# EAGLE design bme680_breakout_v01 (EAGLE 9.6.2)
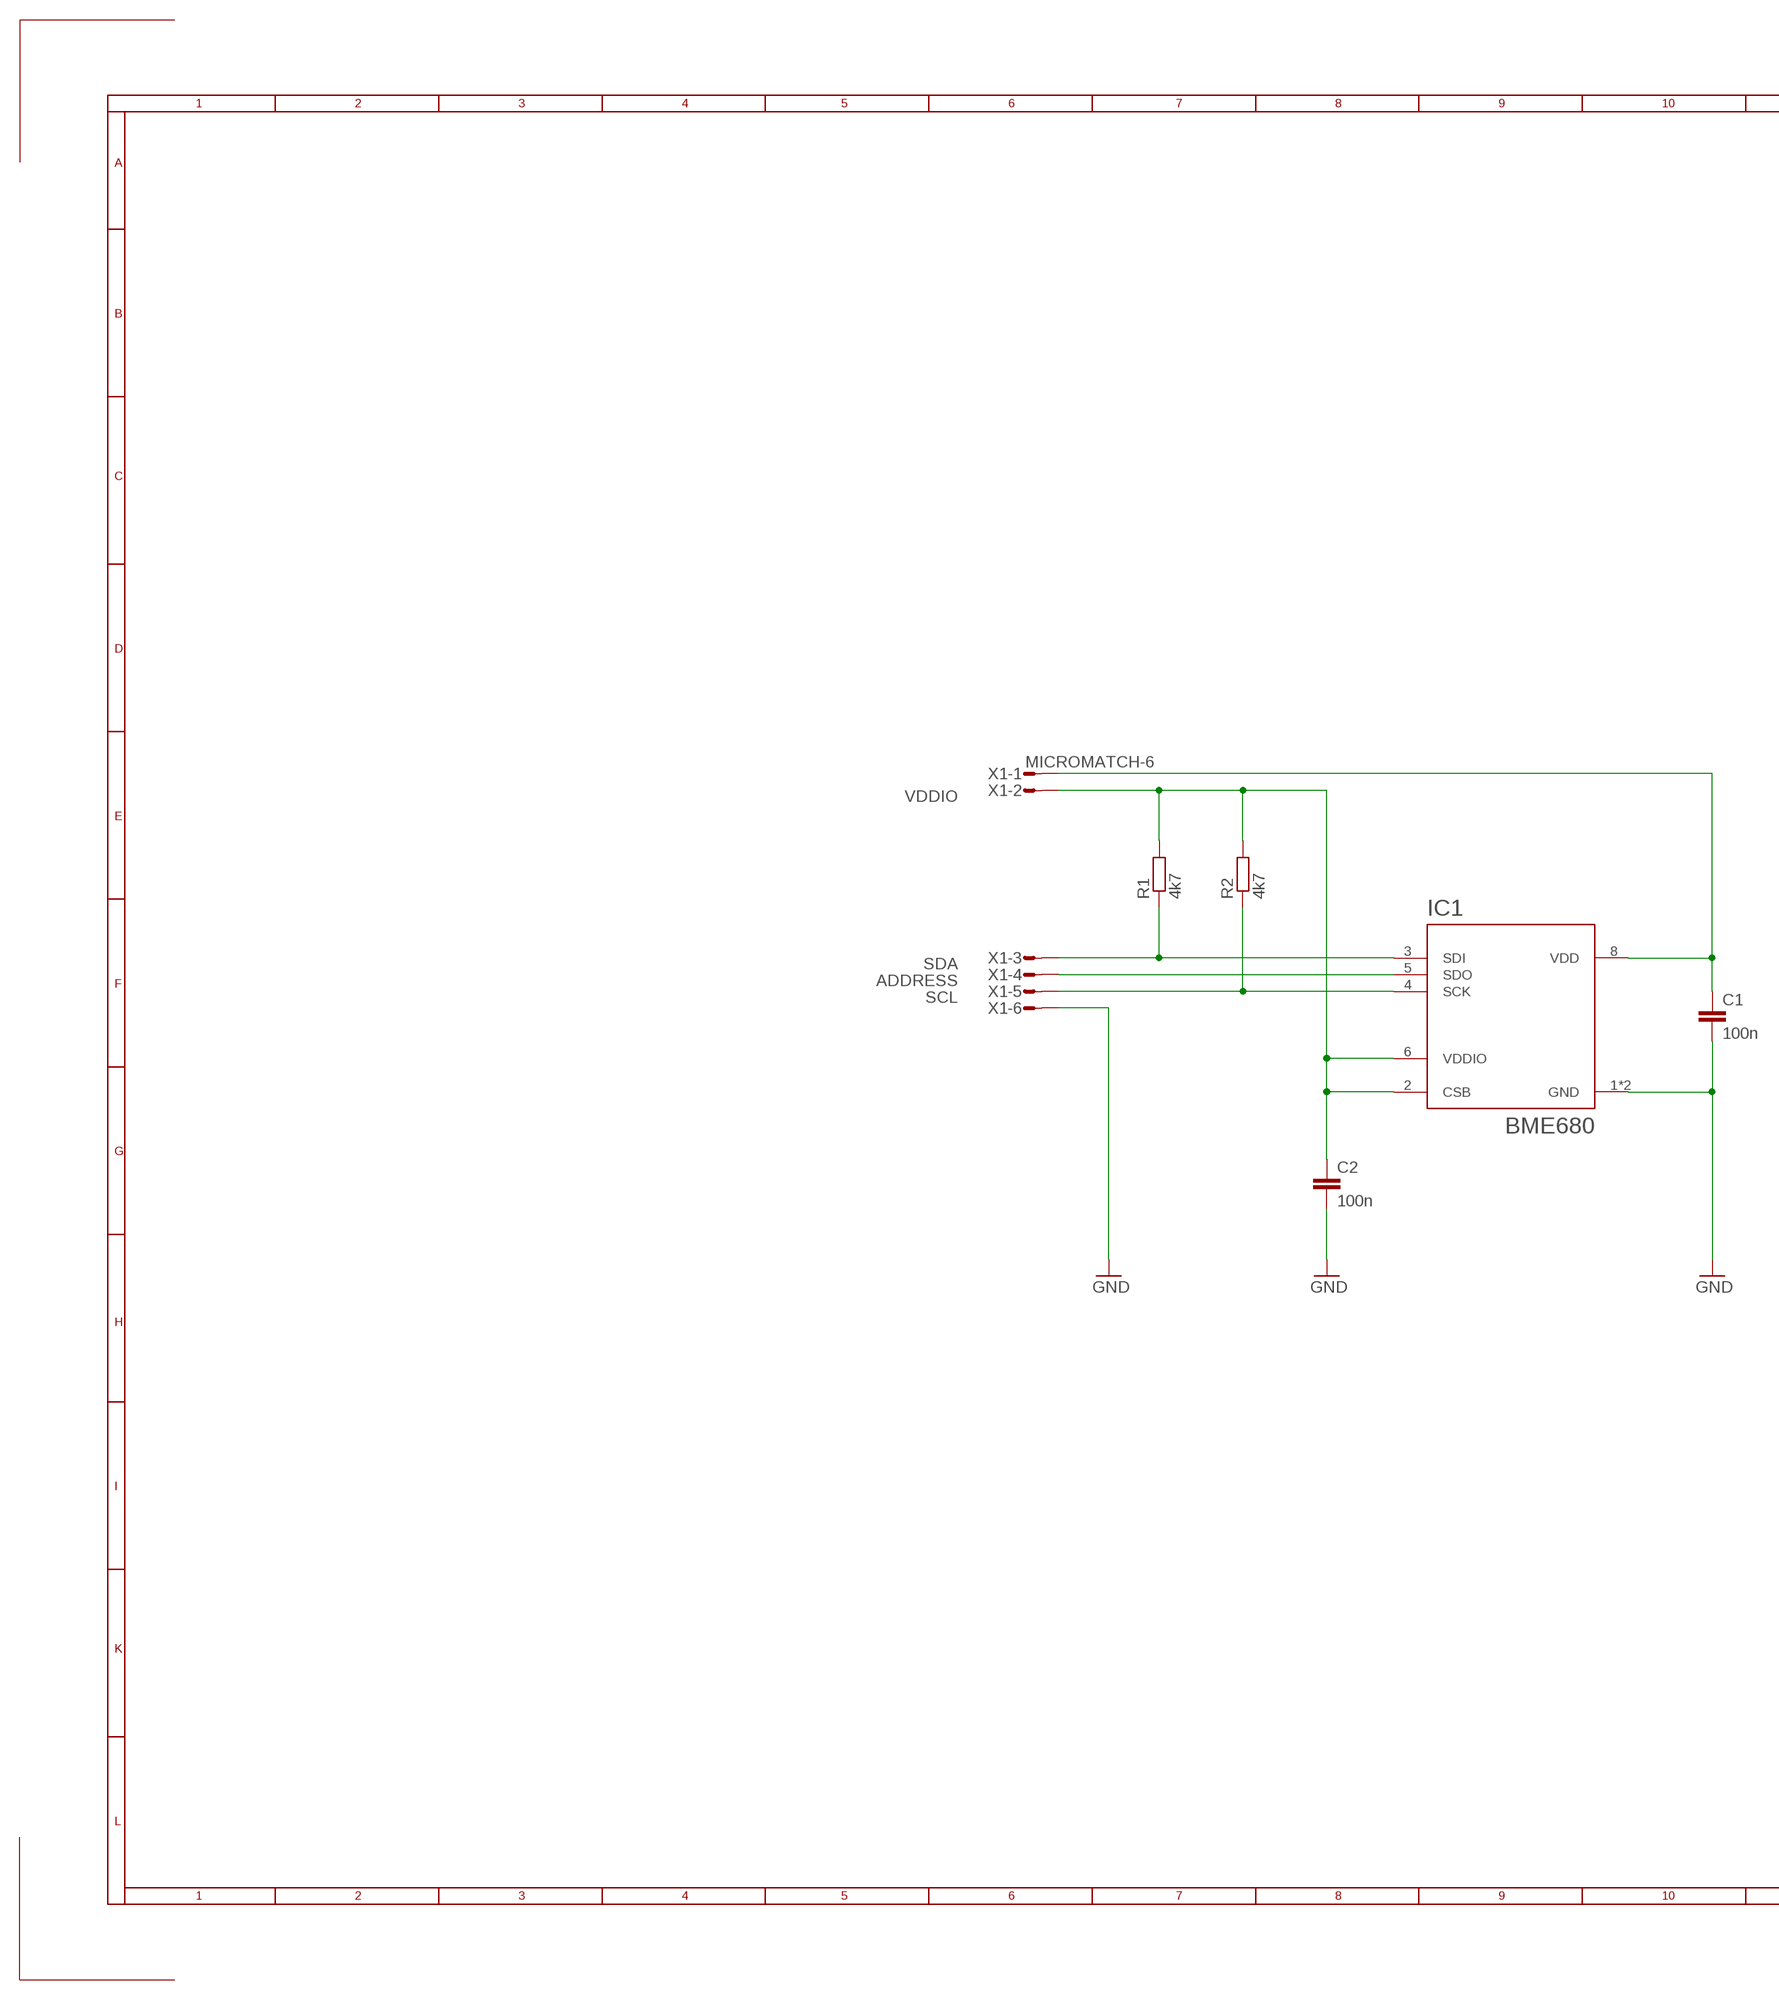
[diagram p0: schematic, sheet 1, part 1 of 2]
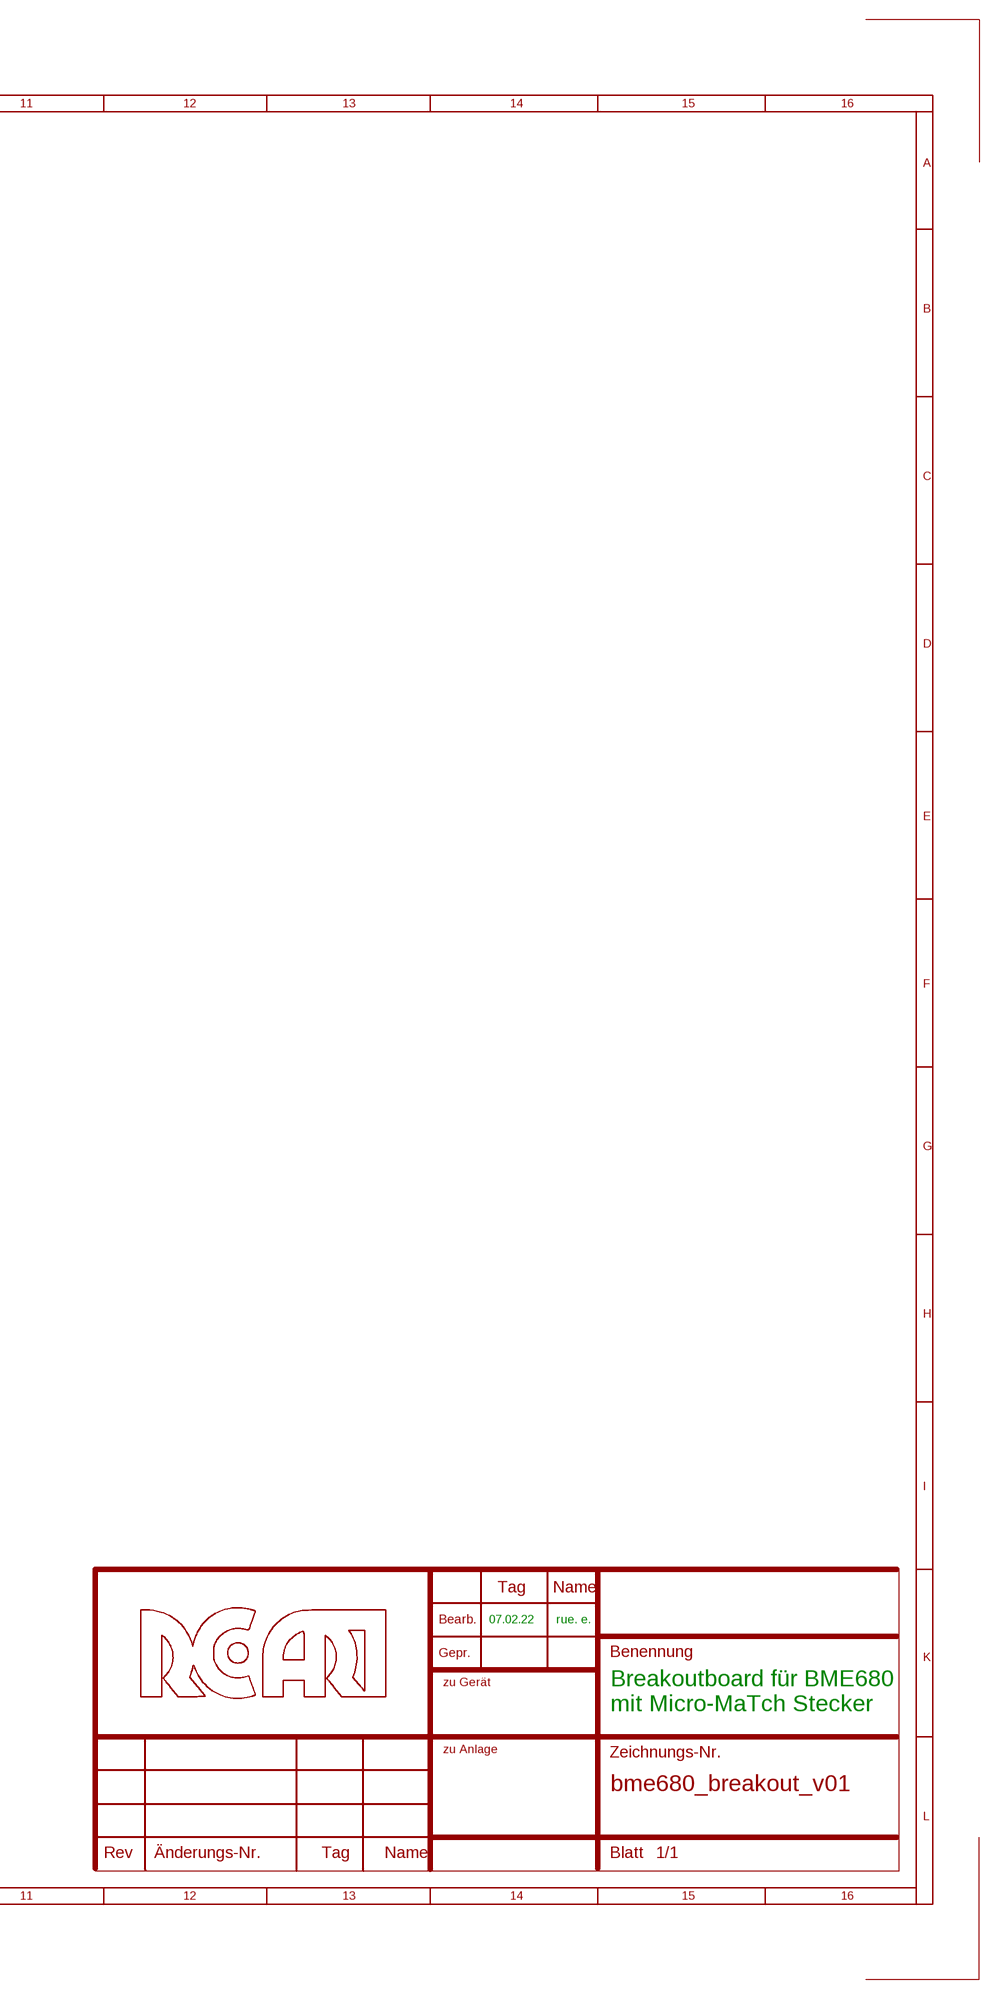
[diagram p1: schematic, sheet 1, part 2 of 2]

## Parts
C1  100n  C-EUC0805K  [C0805K]
C2  100n  C-EUC0805K  [C0805K]
IC1  BME680  [LGA8]
R1  4k7  R-EU_R0603  [R0603]
R2  4k7  R-EU_R0603  [R0603]
X1  MICROMATCH-6  [MICROMATCH-6]

## Nets
ADDRESS: IC1.5(SDO) X1.4
GND: C1.2 C2.2 IC1.1(GND) IC1.7(GND) X1.6
SCL: IC1.4(SCK) R2.1 X1.5
SDA: IC1.3(SDI) R1.1 X1.3
VDD: C1.1 IC1.8(VDD) X1.1
VDDIO: C2.1 IC1.2(CSB) IC1.6(VDDIO) R1.2 R2.2 X1.2

## Notes on the sheet
- 07.02.22 | rue. e.
- Breakoutboard für BME680
  mit Micro-MaTch Stecker

## Library data of the parts
C1 C2 = rcl:C-EU: CAPACITOR, European symbol; SPICEPREFIX: C
IC1 = rca-sensors:BME680: BME680 Gas sensor measuring relative humidity, barometric pressure, ambient temperature and gas (VOC). The BME680 is the first gas sensor that integrates high-linearity and high-accuracy gas, pressure, humidity and temperature sensors. It is especially developed for mobile applications and wearables where size and low power consumption are critical requirements. The BME680 guarantees - depending on the specific operating mode - optimized consumption, long-term stability and high EMC robustness. In order to measure air quality for personal wellbeing the gas sensor within the BME680 can detect a broad range of gases such as volatile organic compounds (VOC). Possible use cases: Personal air quality tracker Air quality mapping Air quality inside cars & public transport Enhanced context awareness Accurate step & calorie tracker Quick GPS-fix & improved navigation Indicator of too high / low humidity Air quality & well-being indicator Sleep / recovery tracker Weather trend Stair counter Floor level detection
R1 R2 = rcl:R-EU_: RESISTOR, European symbol; SPICEPREFIX: R
X1 = con-amp-micromatch:MICROMATCH-6: MicroMaTch 6 7-215464-6 / 0-215464-6 Drawing Number C-215464 DDEController.pdf; MPN: 7-215464-6; OC_FARNELL: 3784630; OC_NEWARK: 19R8125

## Board
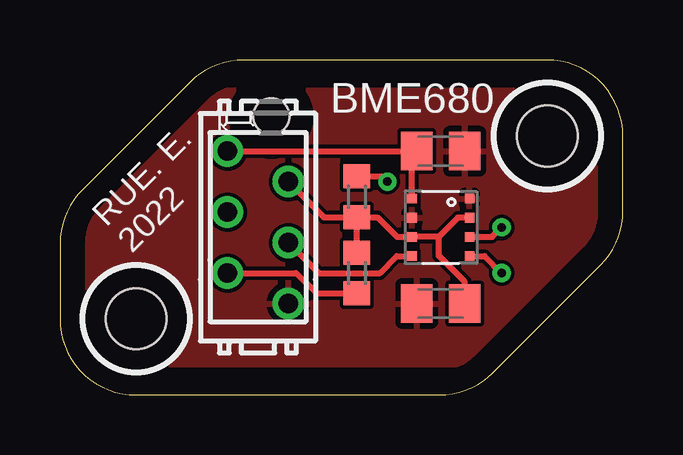
[diagram p2: board, top side]
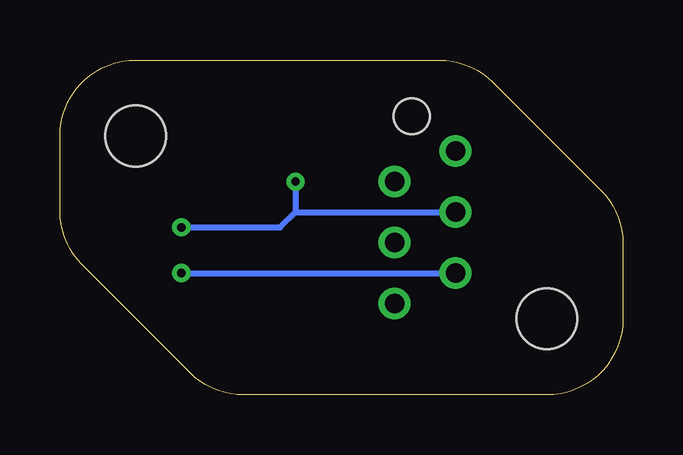
[diagram p3: board, bottom side, seen from below]

Size 23.47 x 13.96 mm. Coordinates in mm from the lower left corner, seen from the top.
Outline: 20.3,13.96 7.66,13.96 arc45 5.42,13.03 0.93,8.54 arc45 0,6.29 0,3.17 arc90 3.17,0 15.81,0 arc45 18.05,0.93 22.54,5.42 arc45 23.47,7.67 23.47,10.78 arc90 20.3,13.96
Copper layers (1*16): Top 0.035mm / dielectric 1.5mm / Bottom 0.035mm
Design rules "default": minimum track width 6mil, minimum drill 0.35mm, track to track 6mil, track to pad 6mil, pad to pad 6mil, via to via 6mil, smd to smd 6mil, copper to edge 40mil, drill to drill 6mil, minimum pad ring 10mil, minimum via ring 8mil, stop-mask expansion 4mil, vias tented up to drill 0mil, thermal gap 10mil
Holes 2.54 mm at 3.17,3.17 20.32,10.79

### Footprints (pad centres in the part's own frame; a part is rotated, then mirrored left to right if it is on the bottom)
C0805K = smd 1.3 x 1.6: 1 -1,0; 2 1,0
LGA8 = smd 0.4 x 0.4: 1 1.2,1.2; 2 1.2,0.4; 3 1.2,-0.4; 4 1.2,-1.2; 5 -1.2,-1.2; 6 -1.2,-0.4; 7 -1.2,0.4; 8 -1.2,1.2
R0603 = smd 1 x 1.1: 1 -0.85,0; 2 0.85,0
MICROMATCH-6 = drill 0.813: 1 3.175,1.27; 2 1.905,-1.27; 3 0.635,1.27; 4 -0.635,-1.27; 5 -1.905,1.27; 6 -3.175,-1.27 | hole 1.5: 4.63,-0.55

### Placement (x,y rotation side)
C1  15.88,10.16 0 top
C2  15.88,3.81 180 top
IC1  15.88,6.99 0 top
R1  12.38,8.26 270 top
R2  12.38,5.08 90 top
X1  8.26,6.99 90 top

### Tracks (layer width: path | path; a pad name or v marks a point on that pad's centre or on a via)
ADDRESS
  Top 0.254: X1.4 10.79,5.08 13.33,5.08 14.04,5.79 IC1.5
GND
  pour Top: 22.86,12.7 22.86,1.27 0.64,1.27 0.64,12.7
SCL  (via drill 0.35)
  Top 0.254: IC1.4 17.71,5.79 v18.41,5.08 | X1.5 9.84,5.08 10.69,4.23 R2.1
  Bottom 0.254: v18.41,5.08 X1.5
SDA  (via drill 0.35)
  Top 0.254: v18.41,6.99 18.02,6.58 IC1.3 | R1.1 13.44,9.11 v13.65,8.89
  Bottom 0.254: 13.65,7.62 X1.3 | v18.41,6.99 14.29,6.99 13.65,7.62 | v13.65,8.89 13.65,7.62
VDD
  Top 0.254: X1.1 C1.1 14.67,9.96 IC1.8
VDDIO
  Top 0.254: X1.2 11.01,7.4 R1.2 | R1.2 13.23,7.4 14.05,6.58 IC1.6 15.79,6.58 | R2.2 R1.2 | IC1.2 16.59,7.38 15.79,6.58 | C2.1 16.88,4.71 15.79,5.8 15.79,6.58

### Text on the board
tPlace: BME680 | RUE. E. / 2022